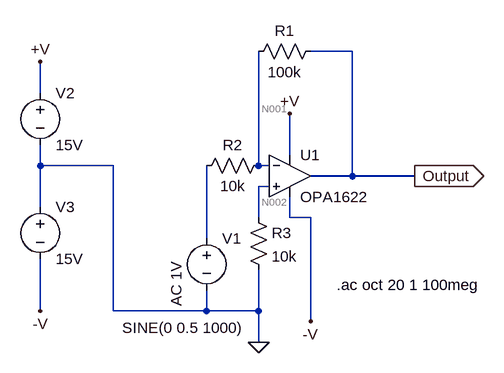
[diagram p0: schematic 25.1_9.(1)_inverting.asc]
25.1_9.(1)_inverting.asc, the LTspice schematic file:
Version 4
SHEET 1 880 680
WIRE 320 0 256 0
WIRE -160 64 -160 16
WIRE 224 160 224 96
WIRE -160 176 -160 144
WIRE -48 176 -160 176
WIRE 176 176 176 0
WIRE 192 176 176 176
WIRE 320 192 320 0
WIRE 320 192 256 192
WIRE 416 192 320 192
WIRE 192 208 176 208
WIRE -160 240 -160 176
WIRE 176 256 176 208
WIRE 224 256 224 224
WIRE 256 256 224 256
WIRE 96 288 96 176
WIRE -160 400 -160 320
WIRE -48 400 -48 176
WIRE 96 400 96 368
WIRE 96 400 -48 400
WIRE 176 400 176 336
WIRE 176 400 96 400
WIRE 256 416 256 256
WIRE 176 448 176 400
FLAG 416 192 Output
IOPIN 416 192 Out
FLAG 176 448 0
FLAG -160 16 +V
FLAG 224 96 +V
FLAG -160 400 -V
FLAG 256 416 -V
SYMBOL voltage -160 48 R0
WINDOW 123 0 0 Left 2
WINDOW 39 0 0 Left 2
SYMATTR InstName V2
SYMATTR Value 15V
SYMBOL voltage -160 224 R0
WINDOW 123 0 0 Left 2
WINDOW 39 0 0 Left 2
SYMATTR InstName V3
SYMATTR Value 15V
SYMBOL voltage 96 272 R0
WINDOW 123 -47 121 VLeft 2
WINDOW 39 0 0 Left 2
WINDOW 3 -130 154 Left 2
SYMATTR Value2 AC 1V
SYMATTR Value SINE(0 0.5 1000)
SYMATTR InstName V1
SYMBOL res 192 160 R90
WINDOW 0 0 56 VBottom 2
WINDOW 3 32 56 VTop 2
SYMATTR InstName R2
SYMATTR Value 10k
SYMBOL res 160 240 R0
SYMATTR InstName R3
SYMATTR Value 10k
SYMBOL res 272 -16 R90
WINDOW 0 0 56 VBottom 2
WINDOW 3 32 56 VTop 2
SYMATTR InstName R1
SYMATTR Value 100k
SYMBOL Opamps\\OPA1622 224 128 R0
SYMATTR InstName U1
TEXT 296 360 Left 2 !.ac oct 20 1 100meg

The netlist it stands for:
* 25.1_9.(1)_inverting.asc
V2 +V 0 15V
V3 0 -V 15V
V1 N003 0 SINE(0 0.5 1000) AC 1V
R2 N001 N003 10k
R3 N002 0 10k
R1 Output N001 100k
XU1 N002 N001 +V -V Output OPA1622  ; pins In+ In- V+ V- OUT
.ac oct 20 1 100meg
.backanno
.end

* Results of the author's LTspice run, read from the files saved beside the schematic
* Operating Point, zero values left out:
*   V(+v) = 15 V
*   V(-v) = -15 V
*   V(n001) = -11.9 mV
*   V(n002) = -12 mV
*   V(output) = -11.9 mV
*   I(R1) = 41.55 pA
*   I(R3) = -1.2 µA
*   I(R2) = -1.19 µA
*   I(V1) = -1.19 µA
*   I(V3) = -2.6 mA
*   I(V2) = -2.6 mA
*   Ix(u1:IN+) = 1.2 µA
*   Ix(u1:IN-) = 1.19 µA
*   Ix(u1:VCC) = 2.6 mA
*   Ix(u1:VEE) = -2.6 mA
*   Ix(u1:OUT) = -41.55 pA
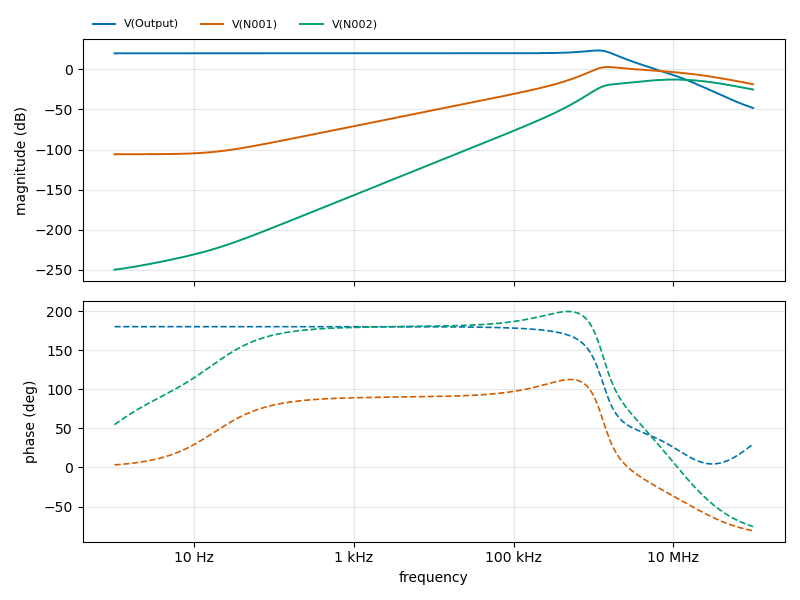
[diagram p1: AC Analysis of 25.1_9.(1)_inverting.asc, plotted from the saved traces]
* AC Analysis, 1 run:
*   V(Output): 20.00 dB at 1 Hz, -48.12 dB at 100 MHz, peak 23.62 dB at 1.124 MHz, 3 dB below the peak at 382.9 kHz and 1.62 MHz
*   V(N001): -105.82 dB at 1 Hz, -18.52 dB at 100 MHz, peak 2.93 dB at 1.535 MHz, 3 dB below the peak at 1.07 MHz and 3.548 MHz
*   V(N002): -249.66 dB at 1 Hz, -25.11 dB at 100 MHz, peak -12.68 dB at 10.33 MHz, 3 dB below the peak at 3.502 MHz and 28.13 MHz